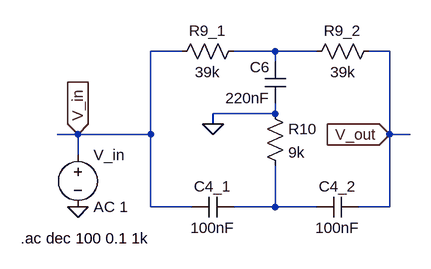
[diagram p0: schematic Experiment_1_b_C.asc]
Experiment_1_b_C.asc, the LTspice schematic file:
Version 4
SHEET 1 880 680
WIRE 64 80 16 80
WIRE 208 80 144 80
WIRE 272 80 208 80
WIRE 384 80 352 80
WIRE 208 96 208 80
WIRE 208 176 208 160
WIRE 208 176 112 176
WIRE 112 192 112 176
WIRE -96 208 -128 208
WIRE 16 208 16 80
WIRE 16 208 -96 208
WIRE 384 208 384 80
WIRE 416 208 384 208
WIRE -96 240 -96 208
WIRE 16 320 16 208
WIRE 80 320 16 320
WIRE 208 320 208 256
WIRE 208 320 144 320
WIRE 272 320 208 320
WIRE 384 320 384 208
WIRE 384 320 336 320
FLAG -96 320 0
FLAG 112 192 0
FLAG -96 208 V_in
IOPIN -96 208 In
FLAG 384 208 V_out
IOPIN 384 208 In
SYMBOL res 160 64 R90
WINDOW 0 0 56 VBottom 2
WINDOW 3 32 56 VTop 2
SYMATTR InstName R9_1
SYMATTR Value 39k
SYMBOL res 368 64 R90
WINDOW 0 0 56 VBottom 2
WINDOW 3 32 56 VTop 2
SYMATTR InstName R9_2
SYMATTR Value 39k
SYMBOL cap 224 160 R180
WINDOW 0 24 56 Left 2
WINDOW 3 24 8 Left 2
SYMATTR InstName C6
SYMATTR Value 220nF
SYMBOL res 192 160 R0
SYMATTR InstName R10
SYMATTR Value 9k
SYMBOL cap 144 304 R90
WINDOW 0 0 32 VBottom 2
WINDOW 3 32 32 VTop 2
SYMATTR InstName C4_1
SYMATTR Value 100nF
SYMBOL cap 336 304 R90
WINDOW 0 0 32 VBottom 2
WINDOW 3 32 32 VTop 2
SYMATTR InstName C4_2
SYMATTR Value 100nF
SYMBOL voltage -96 224 R0
SYMATTR InstName V_in
SYMATTR Value AC 1
TEXT -184 368 Left 2 !.ac dec 100 0.1 1k

The netlist it stands for:
* Experiment_1_b_C.asc
R9_1 N001 V_in 39k
R9_2 V_out N001 39k
C6 0 N001 220nF
R10 0 N002 9k
C4_1 N002 V_in 100nF
C4_2 V_out N002 100nF
V_in V_in 0 AC 1
.ac dec 100 0.1 1k
.backanno
.end